# EAGLE design PSU CLASS AB (EAGLE 9.6.2)
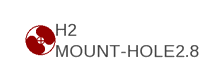
[diagram p0: schematic, sheet 1, part 1 of 2]
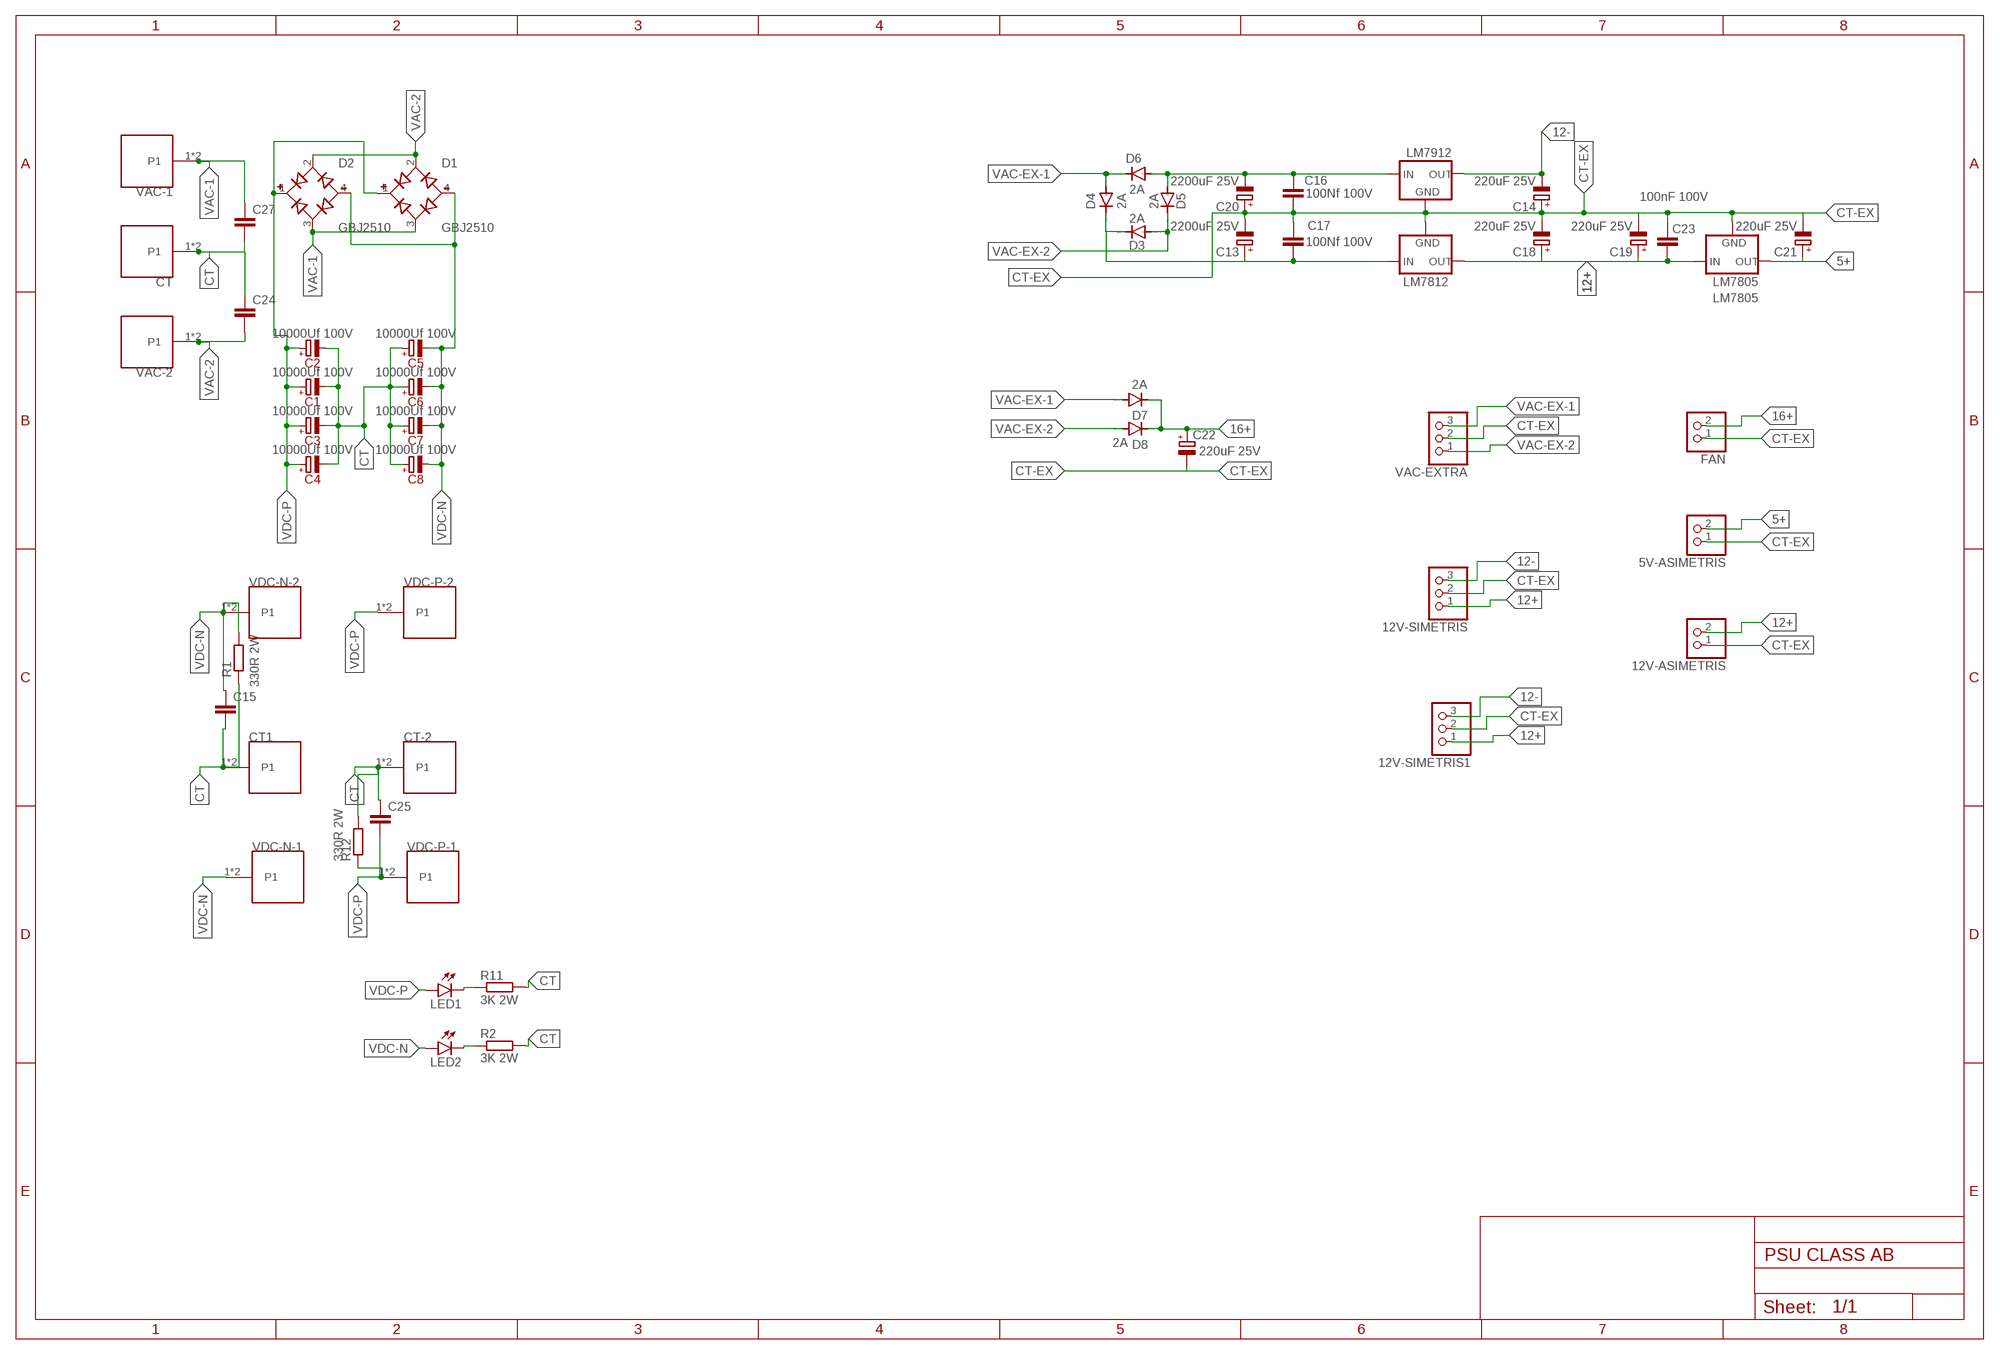
[diagram p1: schematic, sheet 1, part 2 of 2]

## Parts
5V-ASIMETRIS  PINHD-1X2  [1X02]
12V-ASIMETRIS  PINHD-1X2  [1X02]
12V-SIMETRIS  PINHD-1X3  [1X03]
12V-SIMETRIS1  PINHD-1X3  [1X03]
C1  10000Uf 100V  1U/50V  [E1,5-4]
C2  10000Uf 100V  1U/50V  [E1,5-4]
C3  10000Uf 100V  1U/50V  [E1,5-4]
C4  10000Uf 100V  1U/50V  [E1,5-4]
C5  10000Uf 100V  1U/50V  [E1,5-4]
C6  10000Uf 100V  1U/50V  [E1,5-4]
C7  10000Uf 100V  1U/50V  [E1,5-4]
C8  10000Uf 100V  1U/50V  [E1,5-4]
C13  2200uF 25V  CPOL-EUE3.5-8  [E3,5-8]
C14  220uF 25V  CPOL-EUE3.5-8  [E3,5-8]
C15  C10/5  [C10B5]
C16  100Nf 100V  C5/3  [C5B3]
C17  100Nf 100V  C5/3  [C5B3]
C18  220uF 25V  CPOL-EUE3.5-8  [E3,5-8]
C19  220uF 25V  CPOL-EUE3.5-8  [E3,5-8]
C20  2200uF 25V  CPOL-EUE3.5-8  [E3,5-8]
C21  220uF 25V  CPOL-EUE3.5-8  [E3,5-8]
C22  220uF 25V  CPOL-EUE3.5-8  [E3,5-8]
C23  100nF 100V  C5/3  [C5B3]
C24  C10/5  [C10B5]
C25  C10/5  [C10B5]
C27  C10/5  [C10B5]
CT  62409-1  [TE_62409-1]
CT1  62409-1  [TE_62409-1]
CT-2  62409-1  [TE_62409-1]
D1  GBJ2510  [DIOB_GBJ2510]
D2  GBJ2510  [DIOB_GBJ2510]
D3  2A  1N4933  [DO41-10]
D4  2A  1N4933  [DO41-10]
D5  2A  1N4933  [DO41-10]
D6  2A  1N4933  [DO41-10]
D7  2A  1N4933  [DO41-10]
D8  2A  1N4933  [DO41-10]
FAN  PINHD-1X2  [1X02]
H2  MOUNT-HOLE2.8  [2,8]
LED1  LED3MM  [LED3MM]
LED2  LED3MM  [LED3MM]
LM7805  LM7805  78XXS  [78XXS]
LM7812  LM7812  78XXS  [78XXS]
LM7912  LM7912  79XXS  [79XXS]
R1  330R 2W  R-EU_0207/15  [0207/15]
R2  3K 2W  R-EU_0207/15  [0207/15]
R11  3K 2W  R-EU_0207/15  [0207/15]
R12  330R 2W  R-EU_0207/15  [0207/15]
VAC-1  62409-1  [TE_62409-1]
VAC-2  62409-1  [TE_62409-1]
VAC-EXTRA  PINHD-1X3  [1X03]
VDC-N-1  62409-1  [TE_62409-1]
VDC-N-2  62409-1  [TE_62409-1]
VDC-P-1  62409-1  [TE_62409-1]
VDC-P-2  62409-1  [TE_62409-1]

## Nets
5+: 5V-ASIMETRIS.2 C21.+ LM7805.OUT
12+: 12V-ASIMETRIS.2 12V-SIMETRIS1.1 12V-SIMETRIS.1 C18.+ C19.+ C23.1 LM7805.IN LM7812.OUT
12-: 12V-SIMETRIS1.3 12V-SIMETRIS.3 C14.- LM7912.OUT
16+: C22.+ D7.C D8.C FAN.2
CT: C1.- C2.- C3.- C4.- C5.+ C6.+ C7.+ C8.+ C15.2 C24.1 C25.1 C27.2 CT1.1 CT1.2(P1) CT-2.1 CT-2.2(P1) CT.1 CT.2(P1) R1.1 R2.2 R11.2 R12.2
CT-EX: 5V-ASIMETRIS.1 12V-ASIMETRIS.1 12V-SIMETRIS1.2 12V-SIMETRIS.2 C13.- C14.+ C16.1 C17.2 C18.- C19.- C20.+ C21.- C22.- C23.2 FAN.1 LM7805.GND LM7812.GND LM7912.GND VAC-EXTRA.2
N$1: LED2.K(C) R2.1
N$2: LED1.K(C) R11.1
N$4: C16.2 C20.- D5.A D6.A LM7912.IN
N$6: C13.+ C17.1 D3.C D4.C LM7812.IN
VAC-1: C27.1 D1.3(AC2) D2.3(AC2) VAC-1.1 VAC-1.2(P1)
VAC-2: C24.2 D1.2(AC1) D2.2(AC1) VAC-2.1 VAC-2.2(P1)
VAC-EX-1: D4.A D6.C D7.A VAC-EXTRA.3
VAC-EX-2: D3.A D5.C D8.A VAC-EXTRA.1
VDC-N: C5.- C6.- C7.- C8.- C15.1 D1.4(-) D2.4(-) LED2.A R1.2 VDC-N-1.1 VDC-N-1.2(P1) VDC-N-2.1 VDC-N-2.2(P1)
VDC-P: C1.+ C2.+ C3.+ C4.+ C25.2 D1.1(+) D2.1(+) LED1.A R12.1 VDC-P-1.1 VDC-P-1.2(P1) VDC-P-2.1 VDC-P-2.2(P1)

## Library data of the parts
5V-ASIMETRIS 12V-ASIMETRIS FAN = pinhead:PINHD-1X2: PIN HEADER
12V-SIMETRIS 12V-SIMETRIS1 VAC-EXTRA = pinhead:PINHD-1X3: PIN HEADER
C1-C8 = capacitors-electrolytic:?; MOUSER: 647-USW1H010MDD
C13 C14 C18-C22 = rcl:CPOL-EU: POLARIZED CAPACITOR, European symbol; SPICEPREFIX: C
C15 C24 C25 C27 = capacitor-wima:C: CAPACITOR naming: grid - package width
C16 C17 C23 = capacitor edit 8,1:C: CAPACITOR naming: grid - package width
CT CT1 CT-2 VAC-1 VAC-2 VDC-N-1 VDC-N-2 VDC-P-1 VDC-P-2 = 62409-1:62409-1: CONN QC TAB 0.250 SOLDER Check availability <https://pricing.snapeda.com/parts/62409-1/TE%20Connectivity/view-part?ref=eda>; AVAILABILITY: In Stock; COMMENT: 62409-1; DESCRIPTION: Faston 20-16 AWG Straight Non-Insulated Printed Circuit Board Tab Terminal; MF: TE Connectivity; MP: 62409-1; PACKAGE: None; PRICE: None; PURCHASE-URL: https://pricing.snapeda.com/search?q=62409-1&ref=eda
D1 D2 = GBJ2510:GBJ2510: Diode Rectifier Bridge Single 1KV 35A 4-Pin(4+Tab) Case GBJ Bulk/Tube Check availability <https://pricing.snapeda.com/parts/GBJ2510/Diodes%20Inc./view-part?ref=eda>; AVAILABILITY: In Stock; CHECK_PRICES: https://www.snapeda.com/parts/GBJ2510/Diodes+Inc./view-part/?ref=eda; DESCRIPTION: Bridge Rectifier Single Phase Standard 1 kV Through Hole GBJ; MF: Diodes Inc.; MP: GBJ2510; PACKAGE: SIP-4 Diodes Incorporated; PRICE: None; SNAPEDA_LINK: https://www.snapeda.com/parts/GBJ2510/Diodes+Inc./view-part/?ref=snap
D3-D8 = diode:1N4933: DIODE fast recovery rectifier, 1A
H2 = holes:MOUNT-HOLE: MOUNTING HOLE with drill center marker
LED1 LED2 = led:LED: LED OSRAM: - CHIPLED LG R971, LG N971, LY N971, LG Q971, LY Q971, LO R971, LY R971 LH N974, LH R974 LS Q976, LO Q976, LY Q976 LO Q996 - Hyper CHIPLED LW Q18S LB Q993, LB Q99A, LB R99A - SideLED LS A670, LO A670, LY A670, LG A670, LP A670 LB A673, LV A673, LT A673, LW A673 LH A674 LY A675 LS A676, LA A676, LO A676, LY A676, LW A676 LS A679, LY A679, LG A679 - Hyper Micro SIDELED® LS Y876, LA Y876, LO Y876, LY Y876 LT Y87S - SmartLED LW L88C, LW L88S LB L89C, LB L89S, LG L890 LS L89K, LO L89K, LY L89K LS L896, LA L896, LO L896, LY L896 - TOPLED LS T670, LO T670, LY T670, LG T670, LP T670 LSG T670, LSP T670, LSY T670, LOP T670, LYG T670 LG T671, LOG T671, LSG T671 LB T673, LV T673, LT T673, LW T673 LH T674 LS T676, LA T676, LO T676, LY T676, LB T676, LH T676, LSB T676, LW T676 LB T67C, LV T67C, LT T67C, LS T67K, LO T67K, LY T67K, LW E67C LS E67B, LA E67B, LO E67B, LY E67B, LB E67C, LV E67C, LT E67C LW T67C LS T679, LY T679, LG T679 LS T770, LO T770, LY T770, LG T770, LP T770 LB T773, LV T773, LT T773, LW T773 LH T774 LS E675, LA E675, LY E675, LS T675 LS T776, LA T776, LO T776, LY T776, LB T776 LHGB T686 LT T68C, LB T68C - Hyper Mini TOPLED® LB M676 - Mini TOPLED Santana® LG M470 LS M47K, LO M47K, LY M47K Source: http://www.osram.convergy.de LUXEON: - LUMILED® LXK2-PW12-R00, LXK2-PW12-S00, LXK2-PW14-U00, LXK2-PW14-V00 LXK2-PM12-R00, LXK2-PM12-S00, LXK2-PM14-U00 LXK2-PE12-Q00, LXK2-PE12-R00, LXK2-PE12-S00, LXK2-PE14-T00, LXK2-PE14-U00 LXK2-PB12-K00, LXK2-PB12-L00, LXK2-PB12-M00, LXK2-PB14-N00, LXK2-PB14-P00, LXK2-PB14-Q00 LXK2-PR12-L00, LXK2-PR12-M00, LXK2-PR14-Q00, LXK2-PR14-R00 LXK2-PD12-Q00, LXK2-PD12-R00, LXK2-PD12-S00 LXK2-PH12-R00, LXK2-PH12-S00 LXK2-PL12-P00, LXK2-PL12-Q00, LXK2-PL12-R00 Source: www.luxeon.com KINGBRIGHT: KA-3528ASYC Source: www.kingbright.com
LM7805 LM7812 = v-reg:78XXS: VOLTAGE REGULATOR
LM7912 = v-reg:79XXS: VOLTAGE REGULATOR
R1 R2 R11 R12 = resistor coba:R-EU_: RESISTOR, European symbol; SPICEPREFIX: R

## Board
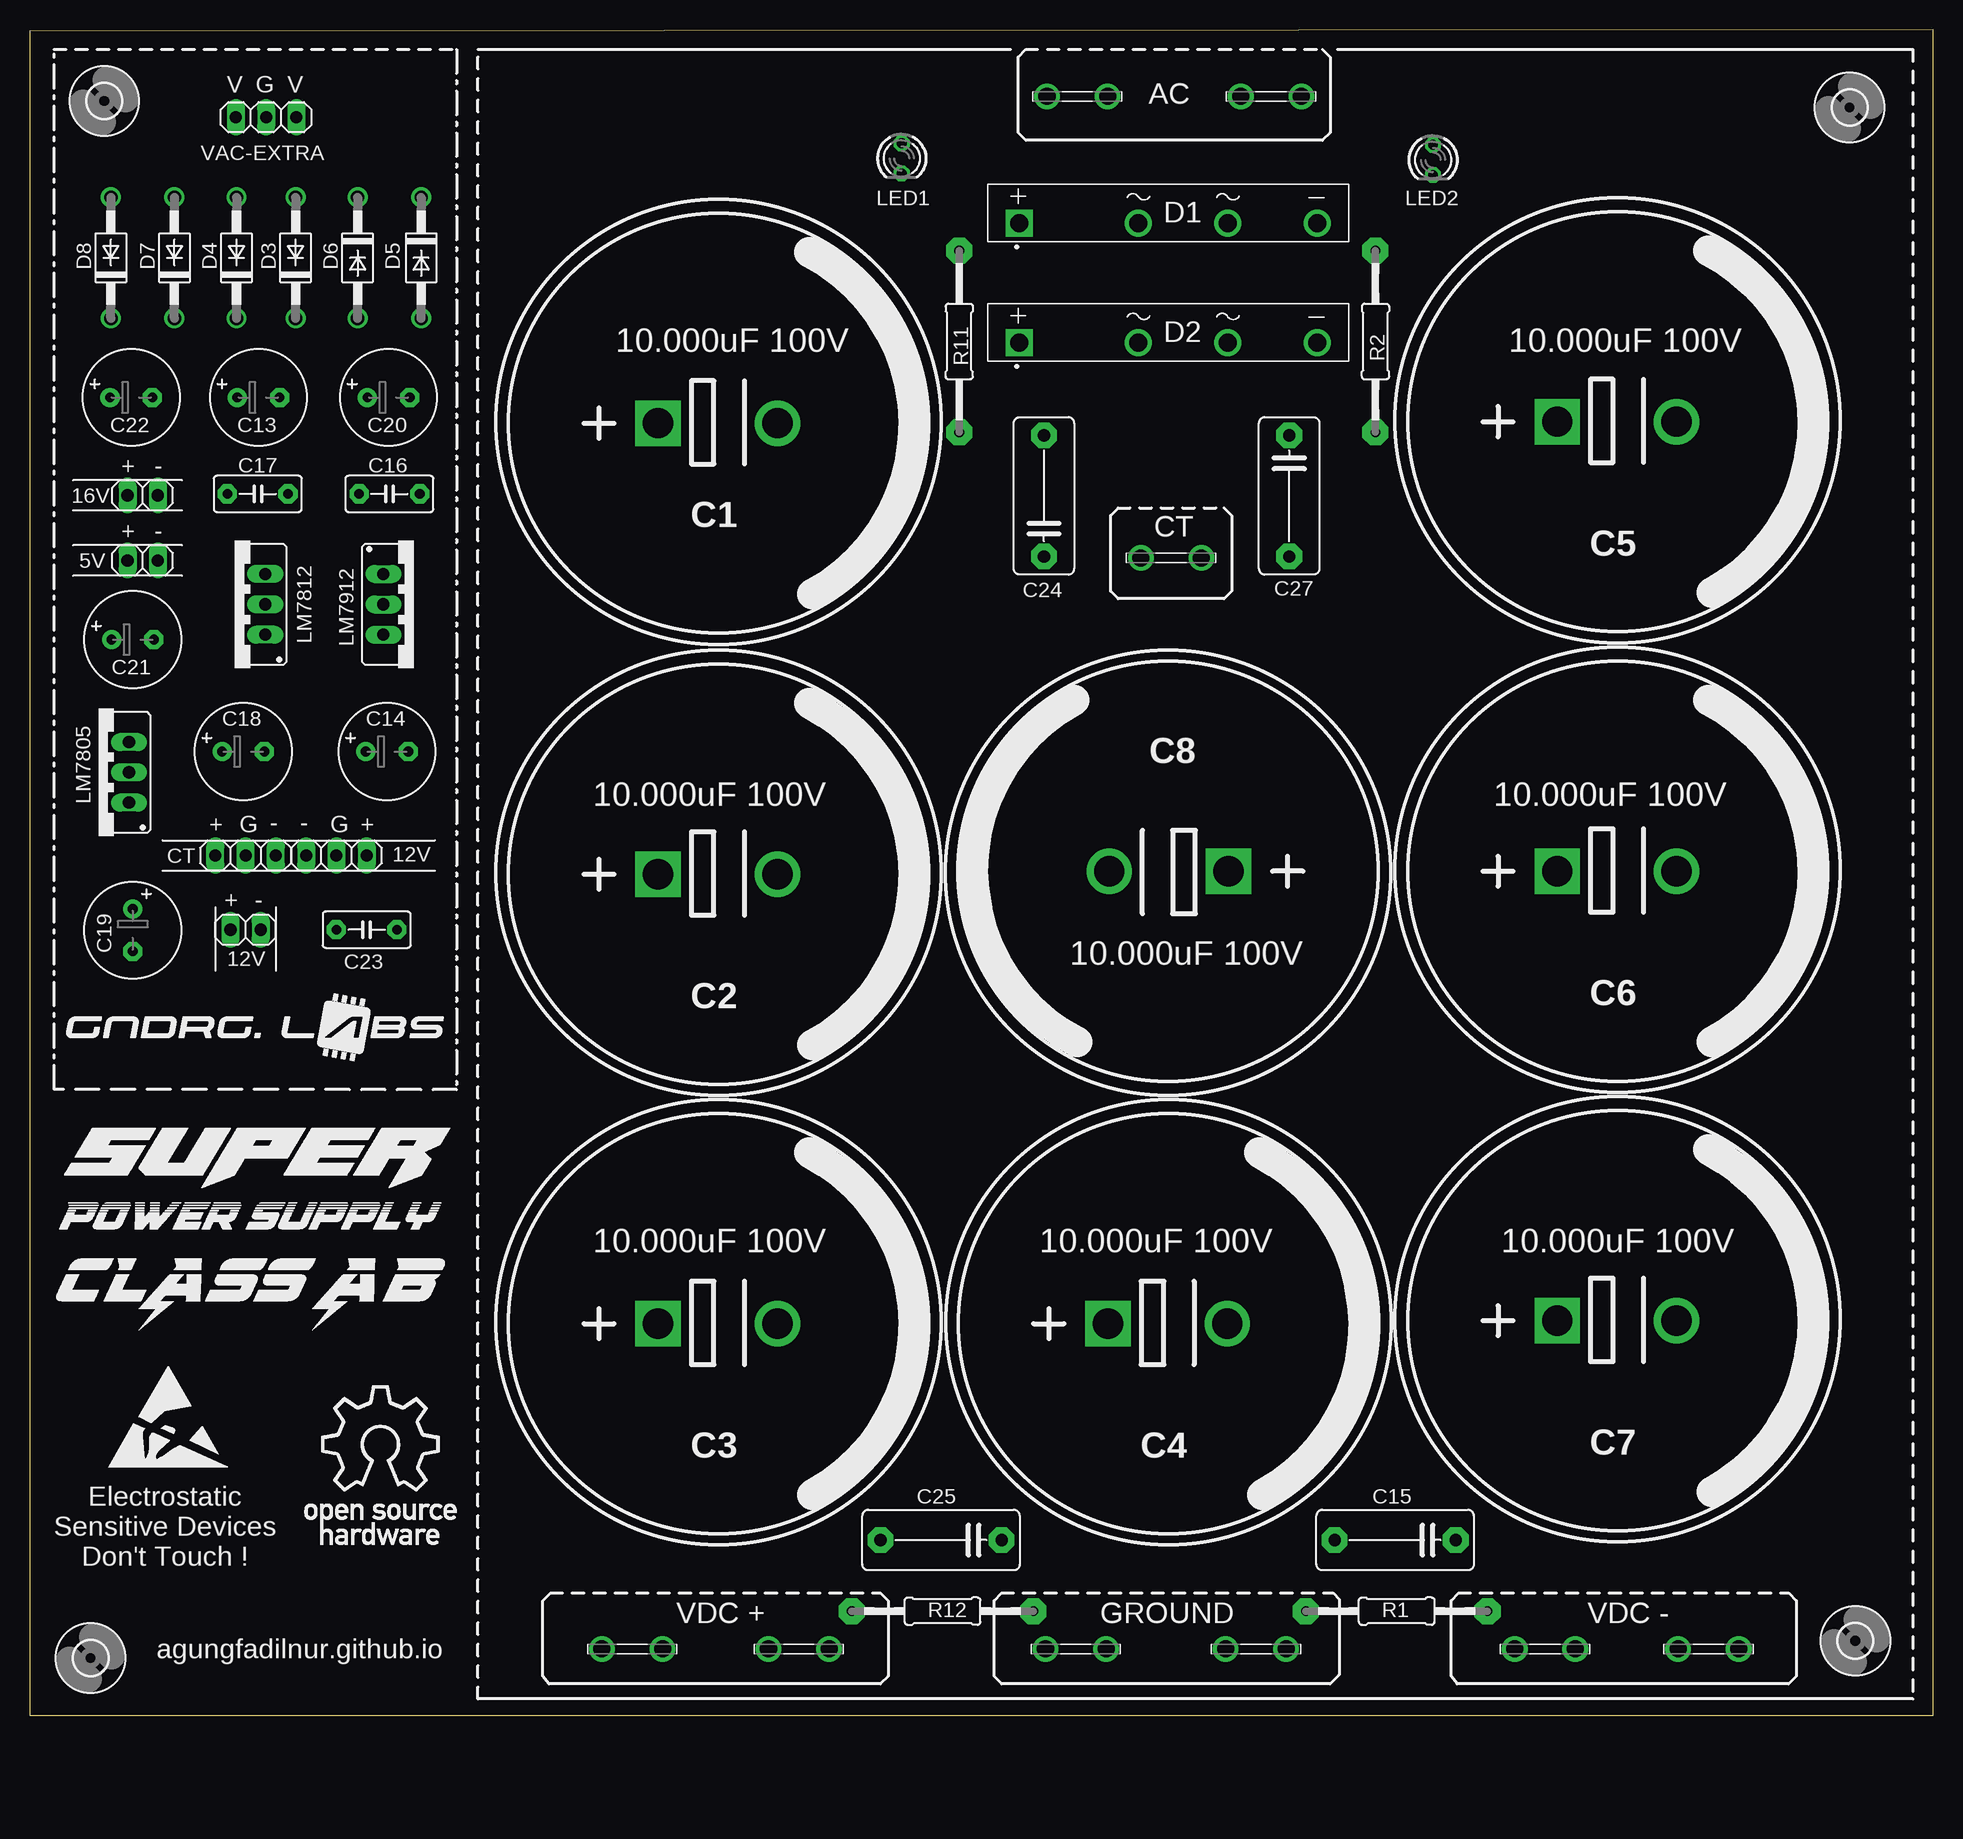
[diagram p2: board, top side]
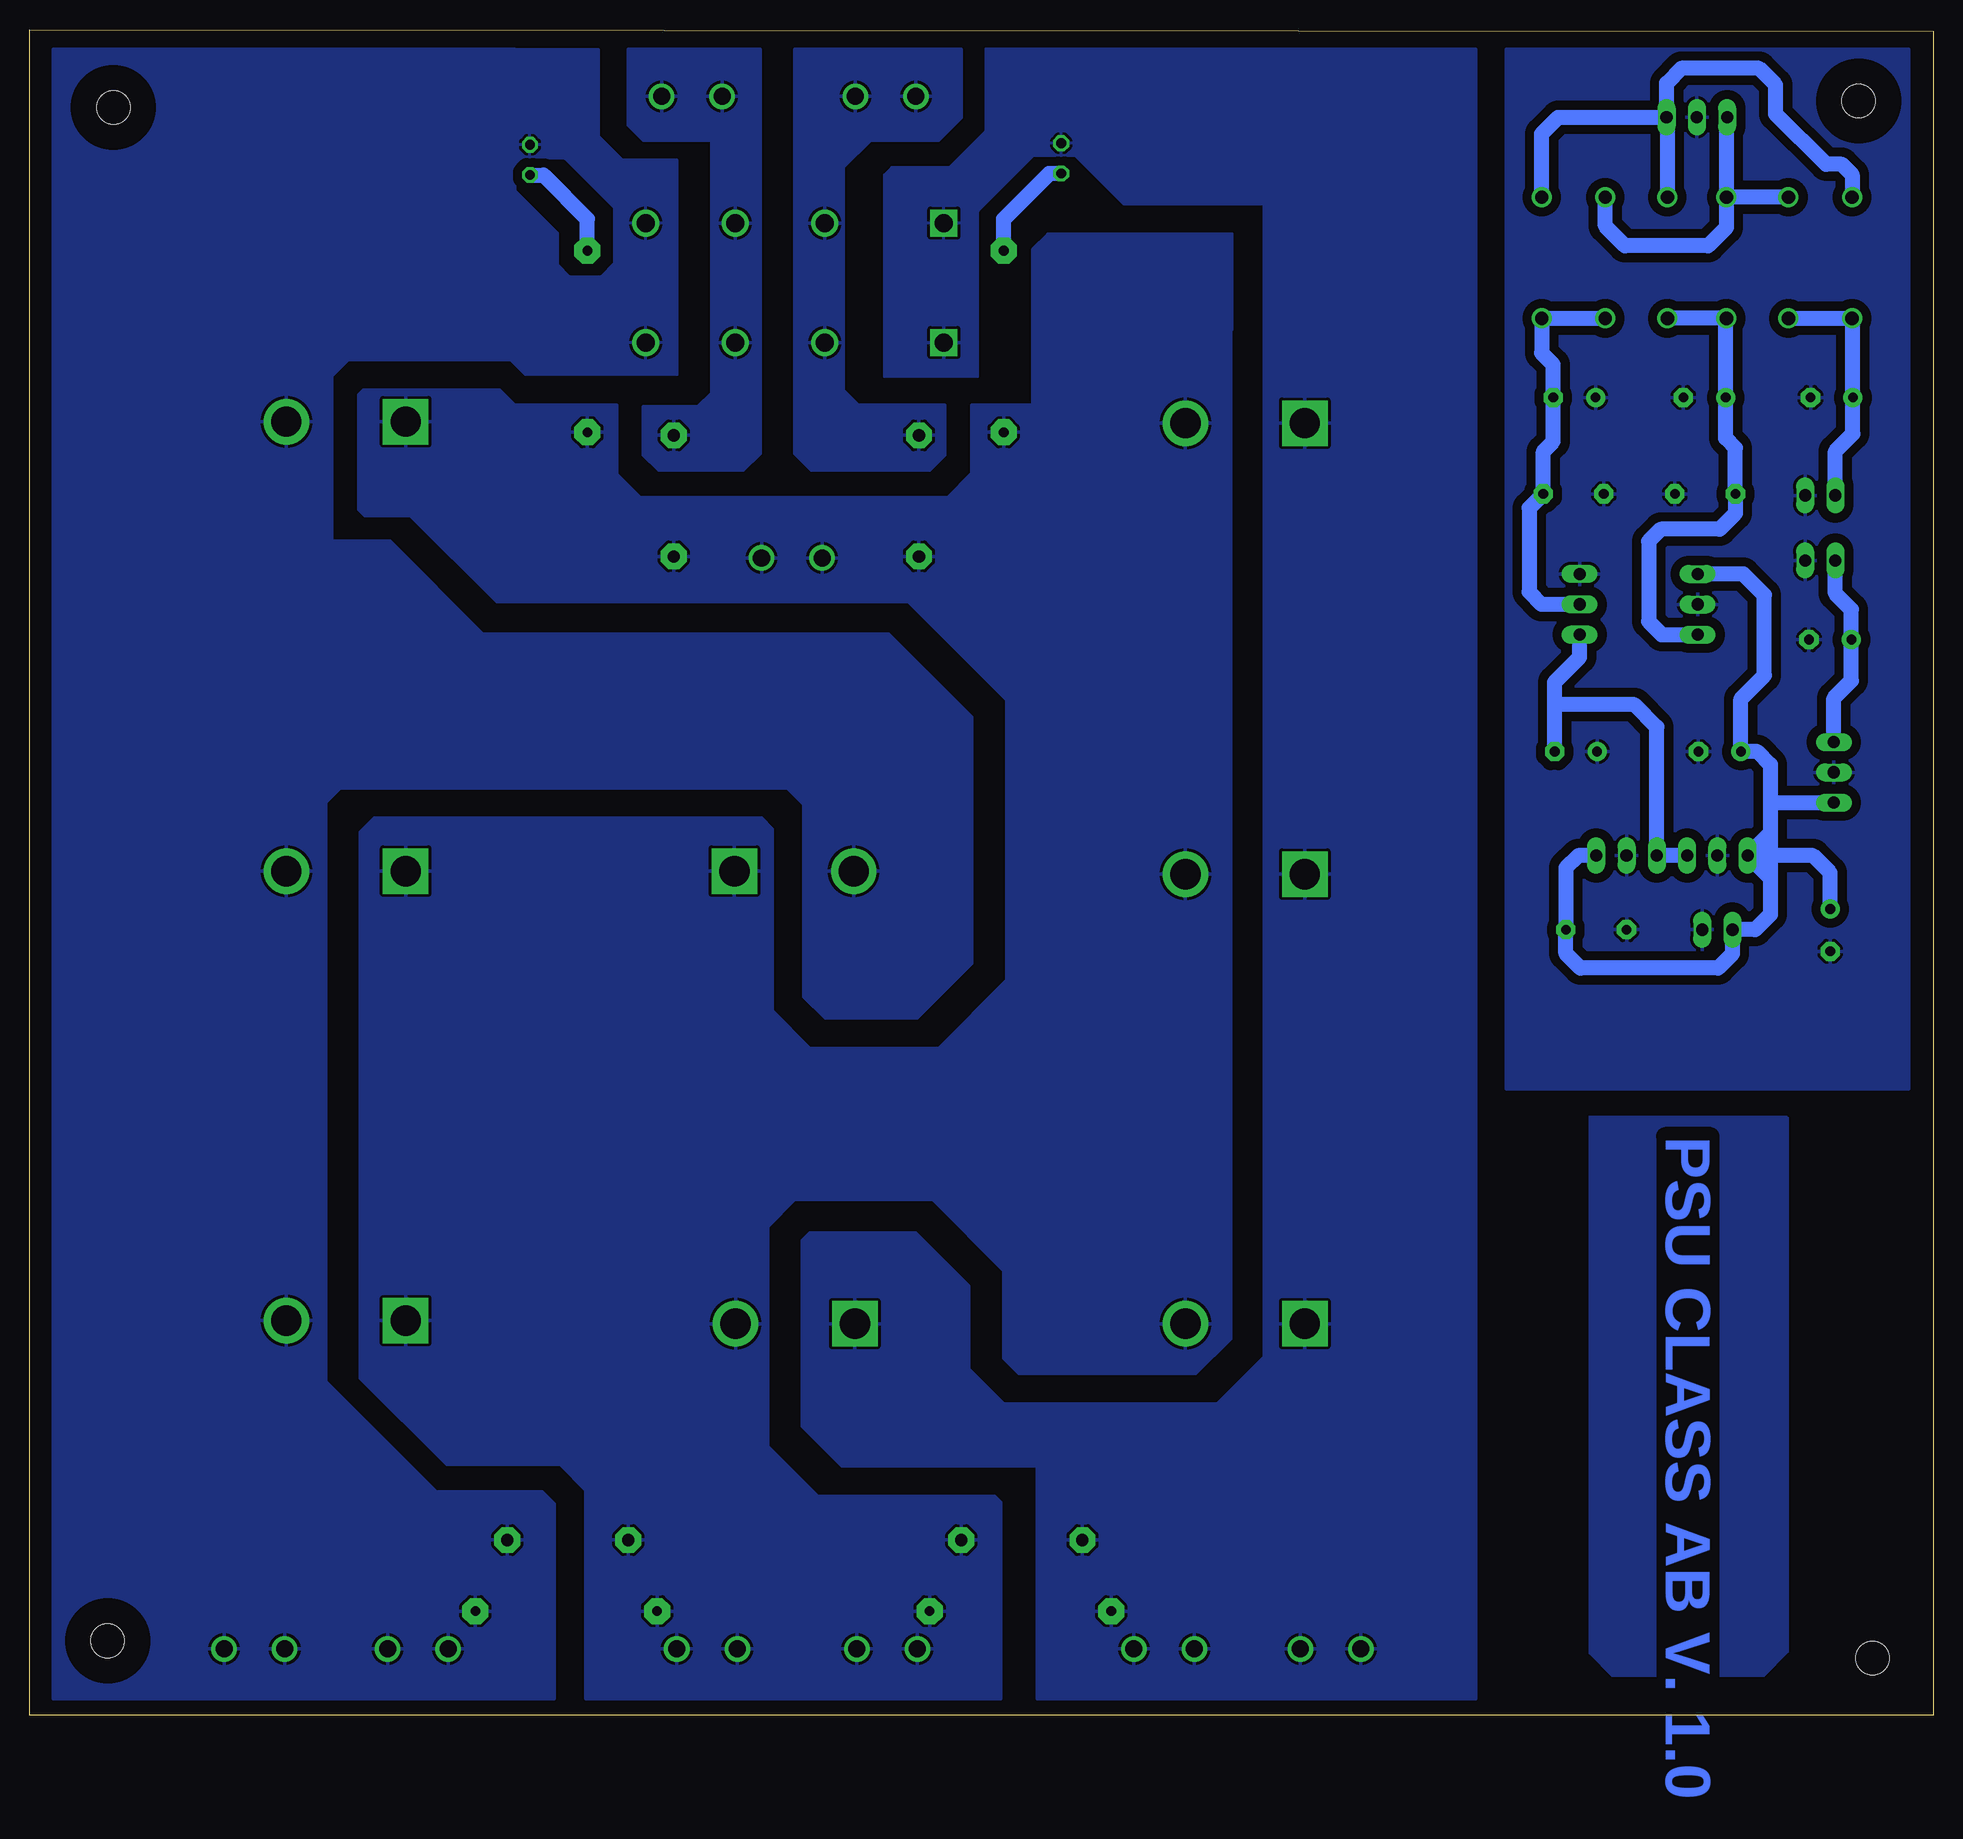
[diagram p3: board, bottom side, seen from below]

Size 159.69 x 141.46 mm. Coordinates in mm from the lower left corner, seen from the top.
Outline: 0,141.33 0,0 159.69,0 159.69,141.46 0,141.33
Copper layers (1*16): Top 0.035mm / dielectric 1.5mm / Bottom 0.035mm
Design rules "default *": minimum track width 6mil, minimum drill 0.35mm, track to track 30mil, track to pad 30mil, pad to pad 30mil, via to via 30mil, smd to smd 30mil, copper to edge 40mil, drill to drill 6mil, minimum pad ring 10mil, minimum via ring 8mil, stop-mask expansion 4mil, vias tented up to drill 0mil, thermal gap 10mil

### Footprints (pad centres in the part's own frame; a part is rotated, then mirrored left to right if it is on the bottom)
1X02 = drill 1.016 long: 1 -1.27,0; 2 1.27,0
1X03 = drill 1.016 long: 1 -2.54,0; 2 0,0; 3 2.54,0
E1,5-4 = drill 2.54 pad 3.81 square: + -4.179,-6.731 | drill 2.54 pad 3.81: - 5.83,-6.731
E3,5-8 = drill 0.813 pad 1.6: + -1.778,0 | drill 0.813 pad 1.6 octagon: - 1.778,0
C10B5 = drill 1.016 pad 2.159 octagon: 1 -5.08,0; 2 5.08,0
C5B3 = drill 0.813 pad 1.6 octagon: 1 -2.54,0; 2 2.54,0
TE_62409-1 = drill 1.43: 1 -2.54,0; 2 2.54,0
DIOB_GBJ2510 = drill 1.51 pad 2.27 square: 1 -12.5,-0.85 | drill 1.51 pad 2.27: 2 -2.5,-0.85; 3 5,-0.85; 4 12.5,-0.85
DO41-10 = drill 1.118: A 5.08,0; C -5.08,0
2,8 = hole 2.8: 0,0
LED3MM = drill 0.813 octagon: A -1.27,0; K 1.27,0
78XXS = drill 1.016 long: GND 0,-2.54; IN -2.54,-2.54; OUT 2.54,-2.54
79XXS = drill 1.016 long: GND -2.54,-2.54; IN 0,-2.54; OUT 2.54,-2.54
0207/15 = drill 0.813 pad 2.184 octagon: 1 -7.62,0; 2 7.62,0

### Placement (x,y rotation side)
5V-ASIMETRIS  9.47,96.92 180 top
12V-ASIMETRIS  18.11,65.93 180 top
12V-SIMETRIS  18.11,72.16 0 top
12V-SIMETRIS1  25.73,72.16 180 top
C1  56.9,115.17 0 top
C2  56.9,77.32 0 top
C3  56.9,39.6 0 top
C4  94.64,39.6 0 top
C5  132.33,115.3 0 top
C6  132.33,77.58 0 top
C7  132.33,39.86 0 top
C8  96.39,64.11 180 top
C13  19.18,110.6 0 top
C14  29.97,80.88 0 top
C15  114.55,14.71 180 top
C16  30.17,102.51 0 top
C17  19.12,102.51 0 top
C18  17.91,80.88 0 top
C19  8.64,65.89 270 top
C20  30.1,110.6 0 top
C21  8.64,90.28 0 top
C22  8.51,110.6 0 top
C23  28.27,65.93 180 top
C24  85.09,102.34 90 top
C25  76.45,14.71 180 top
C27  105.66,102.34 270 top
CT  95.76,97.14 0 top
CT1  102.87,5.57 180 top
CT-2  87.76,5.57 0 top
D1  95.5,126.09 0 top
D2  95.5,116.06 0 top
D3  22.3,122.32 90 top
D4  17.34,122.32 90 top
D5  32.84,122.32 270 top
D6  27.5,122.32 270 top
D7  12.14,122.32 90 top
D8  6.8,122.32 90 top
FAN  9.47,102.38 180 top
H1  MOUNT-HOLE2.8  [2,8]  6.25,135.49 0 top
H2  5.1,4.8 0 top
H3  MOUNT-HOLE2.8  [2,8]  152.68,134.93 0 top
H4  MOUNT-HOLE2.8  [2,8]  153.16,6.26 0 top
LED1  73.15,130.66 270 top
LED2  117.73,130.54 270 top
LM7805  5.79,79.14 90 top
LM7812  17.22,93.24 90 top
LM7912  32.2,93.24 270 top
R1  114.68,8.74 0 top
R2  112.9,115.3 270 top
R11  77.98,115.3 270 top
R12  76.58,8.74 0 top
U$1  [ESD_10.00]  6.52,20.7 0 top
U$5  [OPEN-HARDWARE]  23.04,14.32 0 top
VAC-1  104.14,135.87 180 top
VAC-2  87.88,135.87 0 top
VAC-EXTRA  19.83,134.12 180 top
VDC-N-1  140.84,5.57 180 top
VDC-N-2  127.13,5.57 0 top
VDC-P-1  50.55,5.57 0 top
VDC-P-2  64.52,5.57 0 top

### Tracks (layer width: path | path; a pad name or v marks a point on that pad's centre or on a via)
5+
  Bottom 1.27: LM7805.OUT 8.33,85.37 6.86,86.83 C21.+ 6.86,92.82 8.2,94.16 5V-ASIMETRIS.2
12+
  Bottom 1.27: 13.62,76.6 13.49,76.6 | 13.49,76.6 LM7805.IN | 12V-SIMETRIS1.1 29.79,72.16 30.8,71.14 C23.1 30.8,63.93 29.59,62.72 18.03,62.72 16.84,63.92 12V-ASIMETRIS.2 14.93,65.93 13.66,67.2 13.66,70.25 | 12V-SIMETRIS.1 13.66,70.25 | 13.66,76.43 13.66,79.81 14.73,80.88 C18.+ 16.13,85.31 14.17,87.27 14.17,94.03 15.92,95.78 LM7812.OUT | 13.66,76.43 13.66,74.06 | 13.66,74.06 13.66,72.88 | 13.66,72.88 13.66,71.35 | 13.66,71.35 13.66,70.25 | 12V-SIMETRIS.1 13.66,74.06 | 12V-SIMETRIS.1 14.46,72.16 | 14.46,72.16 13.66,71.35 | C19.+ 8.64,70.72 10.07,72.16 14.46,72.16 | 12V-SIMETRIS.1 14.38,72.16 13.66,72.88 | 13.66,76.43 13.49,76.6
12-
  Bottom 1.27: 12V-SIMETRIS.3 12V-SIMETRIS1.3 23.18,82.95 25.05,84.82 31.75,84.82 | C14.- 31.75,84.82 | 31.75,84.82 31.75,86.71 29.66,88.79 LM7912.OUT
16+
  Bottom 1.27: D7.C D8.C 6.73,117.17 C22.+ 6.73,107.55 8.2,106.08 FAN.2
A
  pour Bottom: 12.19,50.14 12.19,5.31 14.22,3.28 26.92,3.28 28.83,5.19 28.83,50.27 12.32,50.27
CT
  pour Bottom: 80.64,109.96 69.09,109.96 58.93,120.12 58.93,31.6 61.85,28.68 76.71,28.68 77.98,29.95 77.98,37.32 83.95,43.29 95.5,43.29 97.79,41 97.79,22.59 93.6,18.39 78.74,18.39 78.23,17.89 78.23,1.38 113.03,1.38 113.03,18.9 115.19,21.06 124.71,21.06 131.95,28.3 131.95,74.15 130.81,75.29 98.3,75.29 97.41,74.4 97.41,59.16 94.23,55.99 83.44,55.99 77.72,61.7 77.72,85.2 85.98,93.45 120.52,93.45 127.76,100.69 131.57,100.69 132.08,101.2 132.08,110.85 131.7,111.23 120.27,111.23 119,109.96 110.43,109.96 110.43,104.19 108.46,102.22 82.68,102.22 80.64,104.25
  pour Bottom: 58.8,124.31 74.3,124.31 75.56,123.04 75.56,107.8 74.68,106.91 68.2,106.91 58.8,116.31
CT-EX
  pour Bottom: 2.03,139.81 35.81,139.81 35.81,52.55 2.03,52.55
N$1
  Bottom 1.27: R2.1 112.9,125.58 116.59,129.27 LED2.K
N$2
  Bottom 1.27: R11.1 77.98,125.58 74.17,129.39 LED1.K
N$4
  Bottom 1.27: D6.A D5.A 32.84,114.32 31.88,113.36 C20.- 31.88,106.9 32.71,106.07 C16.2 33.89,101.33 33.89,94.27 32.86,93.24 LM7912.IN
N$6
  Bottom 1.27: D3.C D4.C 17.4,117.19 C13.+ 17.4,107.17 16.58,106.35 C17.1 16.58,100.87 17.91,99.55 22.86,99.55 23.88,98.53 23.88,91.8 22.77,90.7 LM7812.IN 20.52,90.7
VAC-1
  pour Bottom: 102.48,111.23 98.41,111.23 98.41,139.81 109.47,139.81 109.47,133.46 108.2,132.19 102.48,132.19
  pour Bottom: 98.42,111.61 98.42,105.9 99.82,104.5 106.93,104.5 108.2,105.77 108.2,109.84 103.63,109.84 102.49,110.98 102.49,111.61
VAC-2
  pour Bottom: 91.43,111.23 95.5,111.23 95.5,139.81 81.53,139.81 81.53,134.09 83.44,132.19 89.15,132.19 91.43,129.91
  pour Bottom: 82.93,109.96 82.93,105.77 84.2,104.5 94.11,104.5 95.5,105.9 95.5,112.5 95.38,112.63 91.44,112.63 91.44,111.23 90.17,109.96
VAC-EX-1
  Bottom 1.27: D4.A 17.34,124.86 18.87,123.34 25.85,123.34 27.5,124.99 D6.C | D4.A 16.96,127.4 | D7.A D4.A | D4.A 17.34,134.06 VAC-EXTRA.3
VAC-EX-2
  Bottom 1.27: D5.C 32.84,132.74 31.45,134.12 VAC-EXTRA.1 | 22.49,134.24 VAC-EXTRA.1 | VAC-EXTRA.1 22.37,136.98 21.14,138.21 14.6,138.21 13.22,136.83 13.22,134.39 8.99,130.16 7.66,130.16 6.8,129.31 D8.A | VAC-EXTRA.1 22.3,134.05 D3.A
VDC-N
  pour Bottom: 119,139.81 119,113.77 132.97,113.77 134.37,112.38 134.37,98.53 129.46,98.53 121.69,90.76 87.6,90.76 80.64,83.8 80.64,63.1 85.22,58.53 92.96,58.53 94.74,60.3 94.74,76.43 96.14,77.83 133.66,77.83 134.87,76.62 134.87,28.05 125.6,18.78 116.71,18.78 115.7,17.76 115.7,1.38 157.73,1.38 157.73,139.81
  pour Bottom: 120.88,139.83 112.01,139.83 112.01,132.57 109.98,130.54 105.41,130.54 105.41,112.5 118.11,112.5 120.9,115.3 120.9,125.96 118.94,127.93 115.44,124.44 115.44,121.77 114.43,120.76 111.76,120.76 110.62,121.9 110.62,126.47 114.81,130.66 118.49,130.66 120.9,128.25 121.92,128.25 121.92,138.79
VDC-P
  pour Bottom: 56.13,139.81 56.13,30.08 60.07,26.14 77.98,26.14 80.9,29.06 80.9,36.05 85.34,40.49 94.23,40.49 94.87,39.86 94.87,24.24 91.57,20.94 75.18,20.94 75.18,1.38 38.35,1.38 38.35,139.81
  pour Bottom: 80.26,123.42 80.26,112.5 87.63,112.5 87.88,112.76 87.88,123.42
  pour Bottom: 88.01,112.38 80.14,112.38 80.14,126.22 75.44,130.92 72.01,130.92 67.94,126.85 53.47,126.85 53.47,139.83 79.5,139.83 79.5,132.95 82.55,129.9 87.38,129.9 88.01,129.27

### Text on the board
Bottom: PSU CLASS AB V. 1.0
tPlace: V G V | AC | 10.000uF 100V | 10.000uF 100V | + - | 16V | + - | 5V | 10.000uF 100V | 10.000uF 100V | + | G | - | - | G | + | CT | 12V | + | - | 12V | 10.000uF 100V | 10.000uF 100V | 10.000uF 100V | 10.000uF 100V | VDC + | GROUND | VDC -
tNames: Electrostatic / Sensitive Devices / Don't Touch ! | agungfadilnur.github.io